# Altium project PCB_Project.PrjPcb
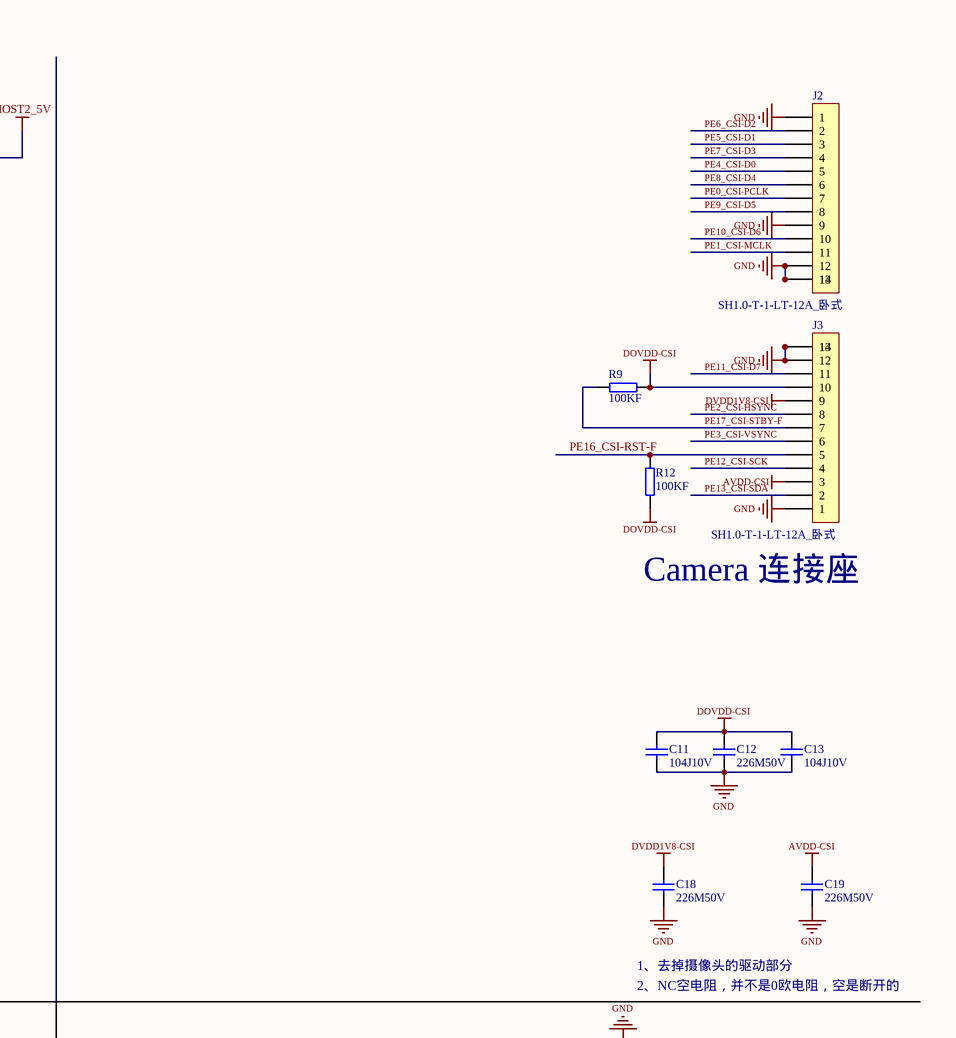
[diagram p0: 机器人底板.SchDoc, top right]
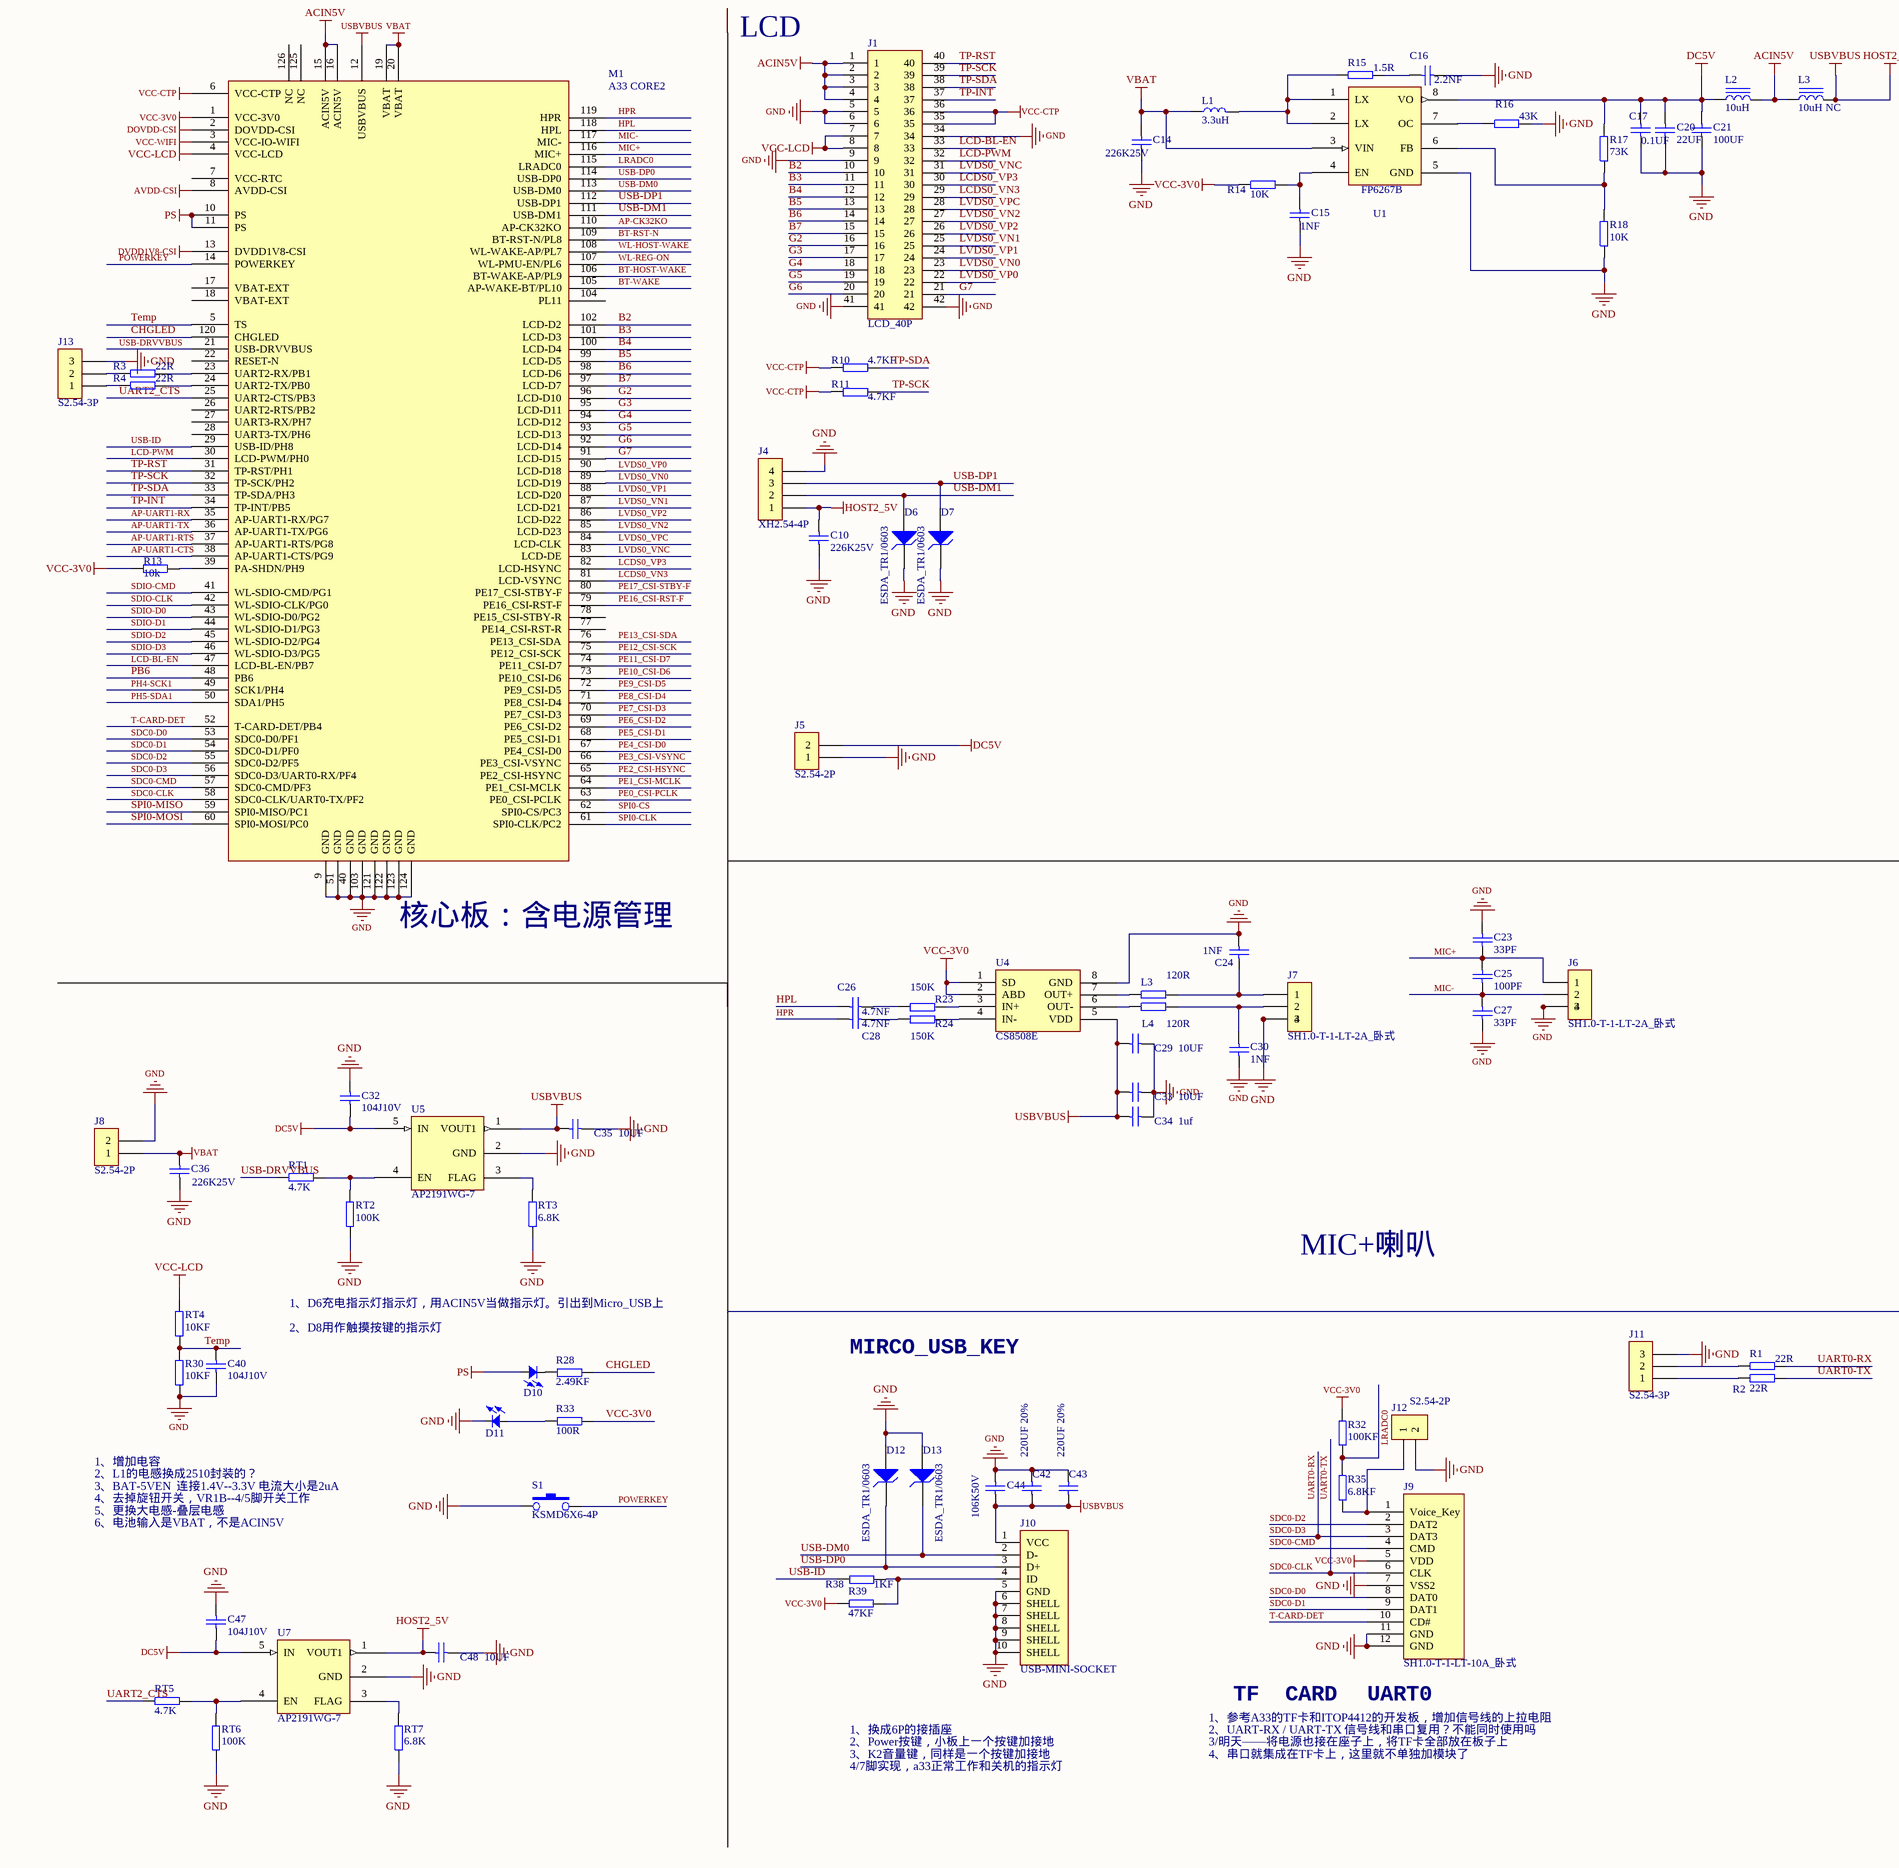
[diagram p1: 机器人底板.SchDoc, bottom left]
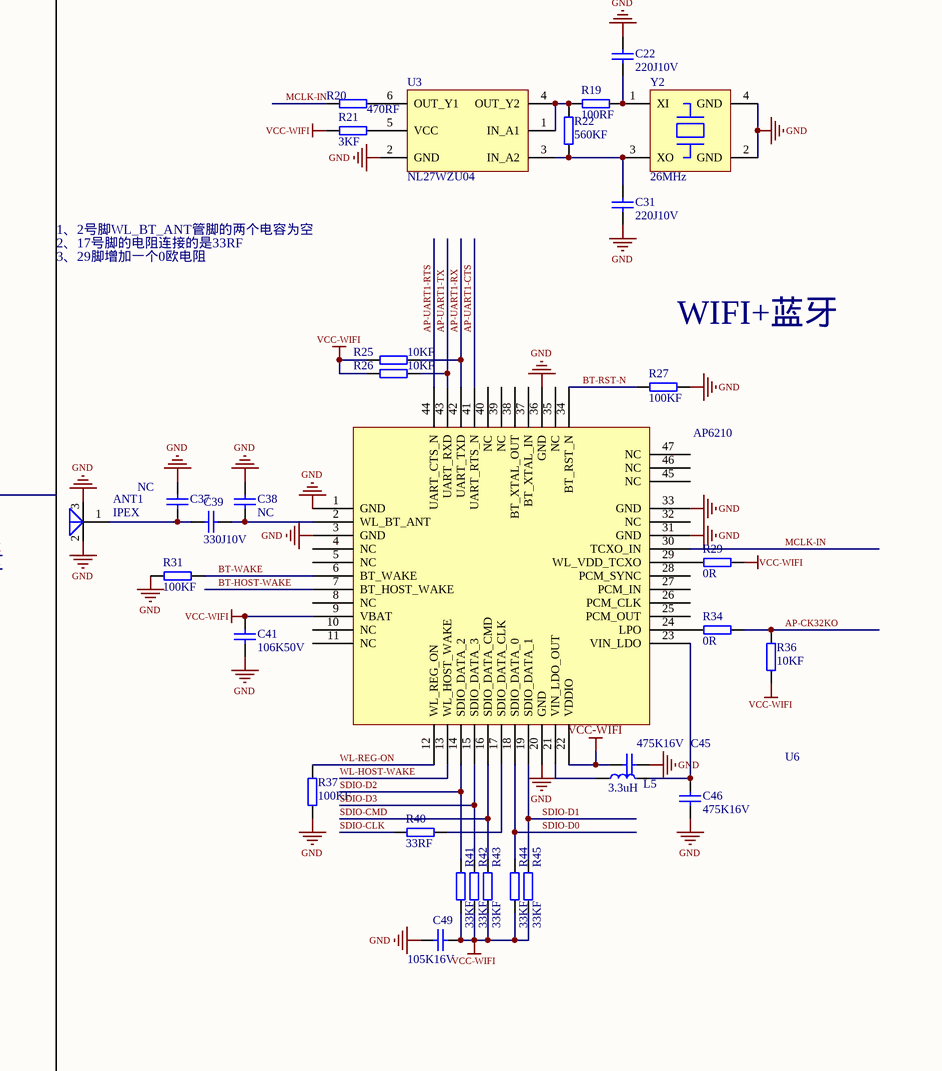
[diagram p2: 机器人底板.SchDoc, bottom right]
1 sheet, 123 parts. Net scope: global (net labels, ports and power ports of the same name join across sheets).
Board file: 机器人.PcbDoc

## Sheet 机器人底板.SchDoc
size A2

### Parts
(Parts that share a designator on the sheet are numbered #1, #2 ... from top to bottom, then left to right.)
ANT1  IPEX  [J-IPEX]
C10  226K25V  [C0805]
C11  104J10V  [C0402]
C12  226M50V  [C0805]
C13  104J10V  [C0402]
C14  226K25V  [C0805]
C15  1NF  [C0402]
C16  2.2NF  [C0603]
C17  0.1UF  [C0402]
C18  226M50V  [C0805]
C19  226M50V  [C0805]
C20  22UF  [C0603]
C21  100UF  [CD3X5.3SMD]
C22  220J10V  [C0402]
C23  33PF  [C0402]
C24  1NF  [C0402]
C25  100PF  [C0402]
C26  4.7NF  [C0603]
C27  33PF  [C0402]
C28  4.7NF  [C0603]
C29  10UF  [C0603]
C30  1NF  [C0402]
C31  220J10V  [C0402]
C32  104J10V  [C0402]
C33  10UF  [C0603]
C34  1uf  [C0603]
C35  10UF  [C0603]
C36  226K25V  [C0805]
C37  NC  [C0402]
C38  NC  [C0402]
C39  330J10V  [C0402]
C40  104J10V  [C0402]
C41  106K50V  [C0603]
C42  220UF 20%  [C1206]
C43  220UF 20%  [C1206]
C44  106K50V  [C0603]
C45  475K16V  [C0603]
C46  475K16V  [C0603]
C47  104J10V  [C0402]
C48  10UF  [C0603]
C49  105K16V  [C0603]
D6  ESDA_TR1/0603  [HS_0603D]
D7  ESDA_TR1/0603  [HS_0603D]
D10  发光二极管  [LEDΦ5-H12]  (value not drawn)
D11  发光二极管  [LEDΦ5-H12]  (value not drawn)
D12  ESDA_TR1/0603  [HS_0603D]
D13  ESDA_TR1/0603  [HS_0603D]
J1  LCD_40P  [LCD P40]
J2  SH1.0-T-1-LT-12A_卧式  [J-SH1.0-T-1-LT-12A_卧式]
J3  SH1.0-T-1-LT-12A_卧式  [J-SH1.0-T-1-LT-12A_卧式]
J4  XH2.54-4P  [XH2.54-4P]
J5  S2.54-2P  [J-SH2.0-T-1-LT-2A_立式]
J6  SH1.0-T-1-LT-2A_卧式  [J-SH1.0-T-1-LT-2A_卧式]
J7  SH1.0-T-1-LT-2A_卧式  [J-SH1.0-T-1-LT-2A_卧式]
J8  S2.54-2P  [J-SH2.0-T-1-LT-2A_立式]
J9  SH1.0-T-1-LT-10A_卧式  [J-SH1.0-T-1-LT-10A_卧式]
J10  USB-MINI-SOCKET  [MICROUSB-B-H4]
J11  S2.54-3P  [S2.54-3P]
J12  S2.54-2P  [S2.54-2P]
J13  S2.54-3P  [S2.54-3P]
L1  3.3uH  [LSMD3521]
L2  10uH  [C0603]
L3#1  10uH NC  [C0603]
L3#2  120R  [R0603]
L4  120R  [R0603]
L5  3.3uH  [L0805]
M1  A33 CORE2  [A33-CORE2]
R1  22R  [R0603]
R2  22R  [R0603]
R3  22R  [R0603]
R4  22R  [R0603]
R9  100KF  [R0603]
R10  4.7KF  [R0402]
R11  4.7KF  [R0402]
R12  100KF  [R0603]
R13  10k  [R0603]
R14  10K  [R0603]
R15  1.5R  [R0603]
R16  43K  [R0603]
R17  73K  [R0603]
R18  10K  [R0603]
R19  100RF  [R0603]
R20  470RF  [R0603]
R21  3KF  [R0603]
R22  560KF  [R0603]
R23  150K  [R0603]
R24  150K  [R0603]
R25  10KF  [R0603]
R26  10KF  [R0603]
R27  100KF  [R0603]
R28  2.49KF  [R0603]
R29  0R  [R0603]
R30  10KF  [R0603]
R31  100KF  [R0603]
R32  100KF  [R0603]
R33  100R  [R0603]
R34  0R  [R0603]
R35  6.8KF  [R0603]
R36  10KF  [R0603]
R37  100KF  [R0603]
R38  1KF  [R0603]
R39  47KF  [R0603]
R40  33RF  [R0603]
R41  33KF  [R0603]
R42  33KF  [R0603]
R43  33KF  [R0603]
R44  33KF  [R0603]
R45  33KF  [R0603]
RT1  4.7K  [0402]
RT2  100K  [0402]
RT3  6.8K  [0402]
RT4  10KF  [0402]
RT5  4.7K  [0402]
RT6  100K  [0402]
RT7  6.8K  [0402]
S1  KSMD6X6-4P  [SW2-6*6H]
U1  FP6267B  [U-SOP-8N-1]
U3  NL27WZU04  [U-TSOP-6]
U4  CS8508E  [SO-8]
U5  AP2191WG-7  [SOT23-5]
U6  AP6210  [AP6210]
U7  AP2191WG-7  [SOT23-5]
Y2  26MHz  [Y-CPX-32GA-4P]

### Nets
ACIN5V: J1.1 J1.2 J1.3 J1.4 L2.2 L3#1.1 M1.15(ACIN5V) M1.16(ACIN5V)
AVDD-CSI: C19.1 J3.3 M1.8(AVDD-CSI)
DC5V: C17.1 C20.2 C21.2 C32.2 C47.2 J5.2 L2.1 R17.2 U1.8(VO) U5.5(IN) U7.5(IN)
DOVDD-CSI: C11.1 C12.1 C13.1 J3.10 M1.2(DOVDD-CSI) R9.2 R12.1
DVDD1V8-CSI: C18.1 J3.9 M1.13(DVDD1V8-CSI)
GND: ANT1.2 ANT1.3 C10.1 C11.2 C12.2 C13.2 C14.1 C15.2 C16.2 C17.2 C18.2 C19.2 C20.1 C21.1 C22.2 C23.1 C24.2 C27.2 C29.2 C30.2 C31.2 C32.1 C33.2 C34.2 C35.2 C36.2 C37.1 C38.1 C40.2 C41.2 C42.2 C43.2 C44.1 C45.1 C46.1 C47.1 C48.2 C49.2 D6.2(K) D7.2(K) D11.K D12.1(A) D13.1(A) J1.5 J1.6 J1.9 J1.34 J1.41 J1.42 J2.1 J2.9 J2.12 J2.13 J2.14 J3.1 J3.12 J3.13 J3.14 J4.4 J5.1 J6.3 J6.4 J7.3 J7.4 J8.2 J9.7(VSS2) J9.11(GND) J9.12(GND) J10.5(GND) J10.6(SHELL) J10.7(SHELL) J10.8(SHELL) J10.9(SHELL) J10.10(SHELL) J11.3 J12.2 J13.3 M1.9(GND) M1.40(GND) M1.51(GND) M1.103(GND) M1.121(GND) M1.122(GND) M1.123(GND) M1.124(GND) R16.1 R18.1 R27.2 R30.1 R31.2 R37.2 RT2.1 RT3.1 RT6.1 RT7.1 S1.1 U1.5(GND) U3.2(GND) U4.8(GND) U5.2(GND) U6.1(GND) U6.3(GND) U6.20(GND) U6.31(GND) U6.33(GND) U6.36(GND) U7.2(GND) Y2.2(GND) Y2.4(GND)
HOST2_5V: C10.2 C29.1 C33.1 C34.1 C35.1 C42.1 C43.1 C44.2 C48.1 J4.1 J10.1(VCC) L3#1.2 M1.12(USBVBUS) U4.5(VDD) U5.1(VOUT1) U7.1(VOUT1)  [also labelled USBVBUS]
PS: D10.A M1.10(PS) M1.11(PS)
VBAT: C14.2 C36.1 J8.1 L1.1 M1.19(VBAT) M1.20(VBAT) U1.3(VIN)
VCC-3V0: J9.5(VDD) M1.1(VCC-3V0) R13.1 R14.2 R32.1 R33.2 R39.2 U4.1(SD) U4.2(ABD)
VCC-CTP: J1.35 J1.36 M1.6(VCC-CTP) R10.1 R11.1
VCC-LCD: J1.7 J1.8 M1.4(VCC-LCD) RT4.2
VCC-WIFI: C41.1 C45.2 C49.1 M1.3(VCC-IO-WIFI) R21.1 R25.1 R26.1 R29.2 R36.1 R41.1 R42.1 R43.1 R44.1 R45.1 U6.9(VBAT) U6.22(VDDIO)
AP-CK32KO: M1.110(AP-CK32KO) R34.2 R36.2
AP-UART1-CTS: M1.38(AP-UART1-CTS/PG9) U6.41(UART_RTS_N)
AP-UART1-RTS: M1.37(AP-UART1-RTS/PG8) U6.44(UART_CTS_N)
AP-UART1-RX: M1.35(AP-UART1-RX/PG7) R25.2 U6.42(UART_TXD)
AP-UART1-TX: M1.36(AP-UART1-TX/PG6) R26.2 U6.43(UART_RXD)
B2: J1.10 M1.102(LCD-D2)
B3: J1.11 M1.101(LCD-D3)
B4: J1.12 M1.100(LCD-D4)
B5: J1.13 M1.99(LCD-D5)
B6: J1.14 M1.98(LCD-D6)
B7: J1.15 M1.97(LCD-D7)
BT-HOST-WAKE: M1.106(BT-WAKE-AP/PL9) U6.7(BT_HOST_WAKE)
BT-RST-N: M1.109(BT-RST-N/PL8) R27.1 U6.34(BT_RST_N)
BT-WAKE: M1.105(AP-WAKE-BT/PL10) R31.1 U6.6(BT_WAKE)
CHGLED: M1.120(CHGLED) R28.2
G2: J1.16 M1.96(LCD-D10)
G3: J1.17 M1.95(LCD-D11)
G4: J1.18 M1.94(LCD-D12)
G5: J1.19 M1.93(LCD-D13)
G6: J1.20 M1.92(LCD-D14)
G7: J1.21 M1.91(LCD-D15)
HPL: C26.1 M1.118(HPL)
HPR: C28.1 M1.119(HPR)
LCD-BL-EN: J1.33 M1.47(LCD-BL-EN/PB7)
LCD-PWM: J1.32 M1.30(LCD-PWM/PH0)
LCDS0_VN3: J1.29 M1.81(LCD-VSYNC)
LCDS0_VP3: J1.30 M1.82(LCD-HSYNC)
LRADC0: M1.115(LRADC0) R32.2 R35.1
LVDS0_VN0: J1.23 M1.89(LCD-D19)
LVDS0_VN1: J1.25 M1.87(LCD-D21)
LVDS0_VN2: J1.27 M1.85(LCD-D23)
LVDS0_VNC: J1.31 M1.83(LCD-DE)
LVDS0_VP0: J1.22 M1.90(LCD-D18)
LVDS0_VP1: J1.24 M1.88(LCD-D20)
LVDS0_VP2: J1.26 M1.86(LCD-D22)
LVDS0_VPC: J1.28 M1.84(LCD-CLK)
MCLK-IN: R20.1 U6.30(TCXO_IN)
MIC+: C23.2 C25.1 J6.1 M1.116(MIC+)
MIC-: C25.2 C27.1 J6.2 M1.117(MIC-)
PB6: M1.48(PB6)
PE0_CSI-PCLK: J2.7 M1.63(PE0_CSI-PCLK)
PE1_CSI-MCLK: J2.11 M1.64(PE1_CSI-MCLK)
PE2_CSI-HSYNC: J3.8 M1.65(PE2_CSI-HSYNC)
PE3_CSI-VSYNC: J3.6 M1.66(PE3_CSI-VSYNC)
PE4_CSI-D0: J2.5 M1.67(PE4_CSI-D0)
PE5_CSI-D1: J2.3 M1.68(PE5_CSI-D1)
PE6_CSI-D2: J2.2 M1.69(PE6_CSI-D2)
PE7_CSI-D3: J2.4 M1.70(PE7_CSI-D3)
PE8_CSI-D4: J2.6 M1.71(PE8_CSI-D4)
PE9_CSI-D5: J2.8 M1.72(PE9_CSI-D5)
PE10_CSI-D6: J2.10 M1.73(PE10_CSI-D6)
PE11_CSI-D7: J3.11 M1.74(PE11_CSI-D7)
PE12_CSI-SCK: J3.4 M1.75(PE12_CSI-SCK)
PE13_CSI-SDA: J3.2 M1.76(PE13_CSI-SDA)
PE16_CSI-RST-F: J3.5 M1.79(PE16_CSI-RST-F) R12.2
PE17_CSI-STBY-F: J3.7 M1.80(PE17_CSI-STBY-F) R9.1
PH4-SCK1: M1.49(SCK1/PH4)
PH5-SDA1: M1.50(SDA1/PH5)
POWERKEY: M1.14(POWERKEY) S1.2
SDC0-CLK: J9.6(CLK) M1.58(SDC0-CLK/UART0-TX/PF2) R2.1  [also labelled UART0-TX]
SDC0-CMD: J9.4(CMD) M1.57(SDC0-CMD/PF3)
SDC0-D0: J9.8(DAT0) M1.53(SDC0-D0/PF1)
SDC0-D1: J9.9(DAT1) M1.54(SDC0-D1/PF0)
SDC0-D2: J9.2(DAT2) M1.55(SDC0-D2/PF5)
SDC0-D3: J9.3(DAT3) M1.56(SDC0-D3/UART0-RX/PF4) R1.1  [also labelled UART0-RX]
SDIO-CLK: M1.42(WL-SDIO-CLK/PG0) R40.2
SDIO-CMD: M1.41(WL-SDIO-CMD/PG1) R43.2 U6.16(SDIO_DATA_CMD)
SDIO-D0: M1.43(WL-SDIO-D0/PG2) R44.2 U6.18(SDIO_DATA_0)
SDIO-D1: M1.44(WL-SDIO-D1/PG3) R45.2 U6.19(SDIO_DATA_1)
SDIO-D2: M1.45(WL-SDIO-D2/PG4) R41.2 U6.14(SDIO_DATA_2)
SDIO-D3: M1.46(WL-SDIO-D3/PG5) R42.2 U6.15(SDIO_DATA_3)
SPI0-CLK: M1.61(SPI0-CLK/PC2)
SPI0-CS: M1.62(SPI0-CS/PC3)
SPI0-MISO: M1.59(SPI0-MISO/PC1)
SPI0-MOSI: M1.60(SPI0-MOSI/PC0)
T-CARD-DET: J9.10(CD#) M1.52(T-CARD-DET/PB4)
Temp: C40.1 M1.5(TS) R30.2 RT4.1
TP-INT: J1.37 M1.34(TP-INT/PB5)
TP-RST: J1.40 M1.31(TP-RST/PH1)
TP-SCK: J1.39 M1.32(TP-SCK/PH2) R11.2
TP-SDA: J1.38 M1.33(TP-SDA/PH3) R10.2
UART2_CTS: M1.25(UART2-CTS/PB3) RT5.2
USB-DM0: D13.2(K) J10.2(D-) M1.113(USB-DM0)
USB-DM1: D6.1(A) J4.2 M1.111(USB-DM1)
USB-DP0: D12.2(K) J10.3(D+) M1.114(USB-DP0)
USB-DP1: D7.1(A) J4.3 M1.112(USB-DP1)
USB-DRVVBUS: M1.21(USB-DRVVBUS) RT1.2
USB-ID: M1.29(USB-ID/PH8) R38.1
WL-HOST-WAKE: M1.108(WL-WAKE-AP/PL7) U6.13(WL_HOST_WAKE)
WL-REG-ON: M1.107(WL-PMU-EN/PL6) R37.1 U6.12(WL_REG_ON)
NetANT1_1: ANT1.1(W) C37.2 C39.2
NetC15_1: C15.1 R14.1 U1.4(EN)
NetC16_1: C16.1 R15.1
NetC22_1: C22.1 R19.2 Y2.1(XI)
NetC24_1: C24.1 J7.1 L3#2.1
NetC26_2: C26.2 R23.1
NetC28_2: C28.2 R24.1
NetC30_1: C30.1 J7.2 L4.1
NetC31_1: C31.1 R22.1 U3.3(IN_A2) Y2.3(XO)
NetC38_2: C38.2 C39.1 U6.2(WL_BT_ANT)
NetC46_2: C46.2 L5.2 U6.23(VIN_LDO)
NetD10_K: D10.K R28.1
NetD11_A: D11.A R33.1
NetJ9_1: J9.1(Voice_Key) J12.1 R35.2
NetJ10_4: J10.4(ID) R38.2 R39.1
NetJ11_1: J11.1 R2.2
NetJ11_2: J11.2 R1.2
NetJ13_1: J13.1 R4.2
NetJ13_2: J13.2 R3.2
NetL1_2: L1.2 R15.2 U1.1(LX) U1.2(LX)
NetL3#2_2: L3#2.2 U4.7(OUT+)
NetL4_2: L4.2 U4.6(OUT-)
NetL5_1: L5.1 U6.21(VIN_LDO_OUT)
NetM1_23: M1.23(UART2-RX/PB1) R3.1
NetM1_24: M1.24(UART2-TX/PB0) R4.1
NetM1_39: M1.39(PA-SHDN/PH9) R13.2
NetR16_2: R16.2 U1.7(OC)
NetR17_1: R17.1 R18.2 U1.6(FB)
NetR19_1: R19.1 R22.2 U3.1(IN_A1) U3.4(OUT_Y2)
NetR20_2: R20.2 U3.6(OUT_Y1)
NetR21_2: R21.2 U3.5(VCC)
NetR23_2: R23.2 U4.3(IN+)
NetR24_2: R24.2 U4.4(IN-)
NetR29_1: R29.1 U6.29(WL_VDD_TCXO)
NetR34_1: R34.1 U6.24(LPO)
NetR40_1: R40.1 U6.17(SDIO_DATA_CLK)
NetRT1_1: RT1.1 RT2.2 U5.4(EN)
NetRT3_2: RT3.2 U5.3(FLAG)
NetRT5_1: RT5.1 RT6.2 U7.4(EN)
NetRT7_2: RT7.2 U7.3(FLAG)

Not connected (* = marked no-connect by the designer): M1 7(VCC-RTC) 17(VBAT-EXT) 18(VBAT-EXT) 22(RESET-N) 26(UART2-RTS/PB2) 27(UART3-RX/PH7) 28(UART3-TX/PH6) 77(PE14_CSI-RST-R) 78(PE15_CSI-STBY-R) 104(PL11) 125(NC) 126(NC); U6 4(NC) 5(NC) 8(NC) 10(NC) 11(NC) 25(PCM_OUT) 26(PCM_CLK) 27(PCM_IN) 28(PCM_SYNC) 32(NC) 35(NC) 37(BT_XTAL_IN) 38(BT_XTAL_OUT) 39(NC) 40(NC) 45(NC) 46(NC) 47(NC)

### Notes on the sheet
- LCD
- Camera 连接座
- 1、去掉摄像头的驱动部分
- 2、NC空电阻，并不是0欧电阻，空是断开的
- (near M1) 核心板：含电源管理
- 1、2号脚WL_BT_ANT管脚的两个电容为空
- 2、17号脚的电阻连接的是33RF
- 3、29脚增加一个0欧电阻
- WIFI+蓝牙
- MIC+喇叭
- 1、D6充电指示灯指示灯，用ACIN5V当做指示灯。引出到Micro_USB上
- 2、D8用作触摸按键的指示灯
- MIRCO_USB_KEY
- 1、增加电容
- 2、L1的电感换成2510封装的？
- 3、BAT-5VEN  连接1.4V--3.3V 电流大小是2uA
- 4、去掉旋钮开关，VR1B--4/5脚开关工作
- 5、更换大电感-叠层电感
- 6、电池输入是VBAT，不是ACIN5V
- 1、参考A33的TF卡和ITOP4412的开发板，增加信号线的上拉电阻
- TF  CARD
- (near J9) UART0
- 1、换成6P的接插座
- 2、Power按键，小板上一个按键加接地
- 3、K2音量键，同样是一个按键加接地
- 4/7脚实现，a33正常工作和关机的指示灯
- 2、UART-RX / UART-TX 信号线和串口复用？不能同时使用吗
- 3/明天——将电源也接在座子上，将TF卡全部放在板子上
- 4、串口就集成在TF卡上，这里就不单独加模块了

### Library data of the parts
ANT1 = J-IPEX: 天线接口IPEX
C10 C14 C36 = C0805X7R-226K25V: 贴片电容-陶瓷; 规格型号: 22uF±10%_25V_X7R_C0805; 生产商: 风华 三星; 供应商: *; 备注: *
C11 C13 C23 C25 C27 C32 C40 C47 = C0402X7R-104J10V: 贴片电容-陶瓷; 规格型号: 100nF±5%_10V_X7R_C0402; 生产商: 风华 三星; 供应商: *; 备注: *
C12 C18 C19 = C0805Y5V-226M50V: 贴片电容-陶瓷; 规格型号: 22uF±20%_50V_Y5V_C0805; 生产商: 风华 三星; 供应商: *; 备注: *
C15 C17 = C0402X7R-101J10V: 贴片电容-陶瓷; 规格型号: 100pF±5%_10V_X7R_C0402; 生产商: 风华 三星; 供应商: *; 备注: *
C16 C20 C21 C26 C28 C29 C33-C35 C48 = C0603X7R-330J25V: 贴片电容-陶瓷; 规格型号: 33pF±5%_25V_X7R_C0603; 生产商: 风华 三星; 供应商: *; 备注: *
C22 C24 C30 C31 C37 C38 = C0402X7R-220J10V: 贴片电容-陶瓷; 规格型号: 22pF±5%_10V_X7R_C0402; 生产商: 风华 三星; 供应商: *; 备注: *
C39 = C0402X7R-330J10V: 贴片电容-陶瓷; 规格型号: 33pF±5%_10V_X7R_C0402; 生产商: 风华 三星; 供应商: *; 备注: *
C41 C44 = C0603X7R-106K50V: 贴片电容-陶瓷; 规格型号: 10uF±10%_50V_X7R_C0603; 生产商: 风华 三星; 供应商: *; 备注: *
C42 C43 = C1206-A型 极性电容: C 1206钽电容 --220UF 10V 3216 A型 有极性电容 3.2mm X 1.6mm; 参数: C 1206钽电容 --220UF 20% 10V 3216 A型 有极性 白色为正 电容 3.2mm X 1.6mm
C45 C46 = C0603X7R-475K16V: 贴片电容-陶瓷; 规格型号: 4.7uF±10%_16V_X7R_C0603; 生产商: 风华 三星; 供应商: *; 备注: *
C49 = C0603X7R-105K16V: 贴片电容-陶瓷; 规格型号: 1uF±10%_16V_X7R_C0603; 生产商: 风华 三星; 供应商: *; 备注: *
D6 D7 D12 D13 = D Zener: Zener Diode; Published: *; LatestRevisionDate: *; LatestRevisionNote: *; PackageReference: *; Publisher: *
J4 = J-XH2.54-4P: 接插件-2.54; 货品编码: 371015; 供应商: *; 规格型号: XH2.54-4P; 备注: *
J5 J8 J12 = J-S2.54-2P: 单排排针-直针; 货品编码: 372013; 供应商: *; 规格型号: S2.54-2P; 备注: *
J10 = J-USB-MINI-SOCKET: USB-A卧式插座; 供应商: *; 备注: *
J11 J13 = J-S2.54-3P: 单排排针-直针; 货品编码: 372015; 供应商: *; 规格型号: S2.54-3P; 备注: *
L1 = 3.3uH: 贴片电感-屏蔽; 生产商: *; 供应商: *; 备注: *
L2 L3#1 = LI-0608-10uH1A: 插件电感-工形; 货品编码: 无样品无编码; 生产商: *; 规格型号: LI-0608-10uH1A; 供应商: *; 备注: *
L3#2 L4 R39 = R0603-47KF: 贴片电阻-通用; 生产商: 厚声 国巨; 规格型号: 47K±1%_1/10W_±200ppm_R0603; 货品编码: 无样品无编码; 备注: *; 供应商: *
L5 = L-0805-3.3uH: 贴片电感-层叠; 规格型号: L0805-3.3uH; 生产商: *; 供应商: *; 备注: *
R1-R4 R9 R12 R27 R31 R32 R37 = R0603-100KF: 贴片电阻-通用; 生产商: 厚声 国巨; 规格型号: 100K±1%_1/10W_±200ppm_R0603; 货品编码: 无样品无编码; 备注: *; 供应商: *
R10 R11 = R0402-4.7KF: 贴片电阻-通用
R13 R23-R26 R30 R36 = R0603-10KF: 贴片电阻-通用; 生产商: 厚声 国巨; 规格型号: 10K±1%_1/10W_±200ppm_R0603; 备注: *; 供应商: *
R14-R18 R33 = R0603-2KF: 贴片电阻-通用; 生产商: 厚声 国巨; 规格型号: 2K±1%_1/10W_±200ppm_R0603; 备注: *; 供应商: *
R19 = R0603-100RF: 贴片电阻-通用; 生产商: 厚声 国巨; 规格型号: 100R±1%_1/10W_±200ppm_R0603; 备注: *; 供应商: *
R20 = R0603-470RF: 贴片电阻-通用; 生产商: 厚声 国巨; 规格型号: 470R±1%_1/10W_±200ppm_R0603; 货品编码: 无样品无编码; 备注: *; 供应商: *
R21 R28 = R0603-3KF: 贴片电阻-通用; 生产商: 厚声 国巨; 规格型号: 3K±1%_1/10W_±200ppm_R0603; 货品编码: 无样品无编码; 备注: *; 供应商: *
R22 = R0603-560KF: 贴片电阻-通用; 生产商: 厚声 国巨; 规格型号: 560K±1%_1/10W_±200ppm_R0603; 备注: *; 供应商: *
R29 R34 = R0603-0R: 贴片电阻-通用; 生产商: 厚声 国巨; 规格型号: 0R_1/10W_±200ppm_R0603; 货品编码: 无样品无编码; 备注: *; 供应商: *
R35 = R0603-6.8KF: 贴片电阻-通用; 生产商: 厚声 国巨; 规格型号: 6.8K±1%_1/10W_±200ppm_R0603; 货品编码: 无样品无编码; 备注: *; 供应商: *
R38 = R0603-1KF: 贴片电阻-通用; 生产商: 厚声 国巨; 规格型号: 1K±1%_1/10W_±200ppm_R0603; 货品编码: 无样品无编码; 备注: *; 供应商: *
R40 = R0603-33RF: 贴片电阻-通用; 生产商: 厚声 国巨; 规格型号: 33R±1%_1/10W_±200ppm_R0603; 货品编码: 无样品无编码; 备注: *; 供应商: *
R41-R45 = R0603-33KF: 贴片电阻-通用; 生产商: 厚声 国巨; 规格型号: 33K±1%_1/10W_±200ppm_R0603; 备注: *; 供应商: *
RT1-RT7 = R0603-10KF: 贴片电阻-通用; 生产商: 厚声 国巨; 规格型号: 10K±1%_1/10W_±200ppm_R0402; 备注: *; 供应商: *
S1 = S-KSMD6X6-4P: 轻触按键; 货品编码: 232013; 规格型号: 6x6 SMD贴片按键; 备注: *; 供应商: *; 生产商: *
Y2 = YC-26MHz: 晶振-贴片无源; 规格型号: 26MHz_贴片晶振3225; 生产商: *; 供应商: *; 备注: *